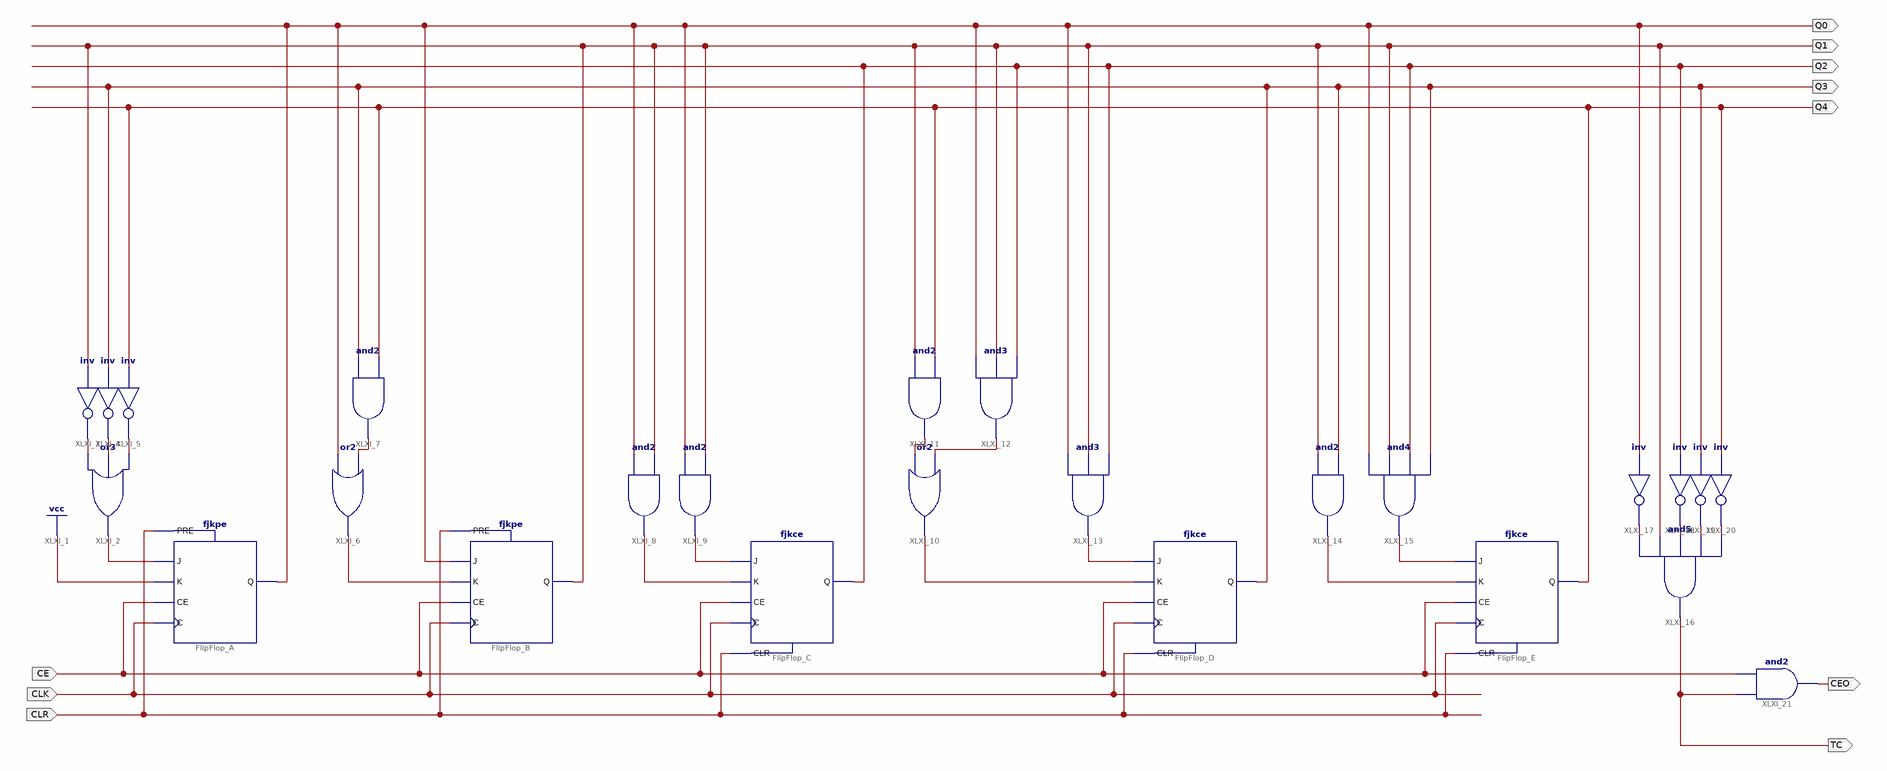
[diagram p0: schematic sheet 1]
// Xilinx ISE schematic counterm0.sch (spartan6) as structural Verilog: 25 symbols, 10 ports
module counterm0 (
  input  CE,
  input  CLK,
  input  CLR,
  output CEO,
  output TC,
  output Q0,
  output Q1,
  output Q2,
  output Q3,
  output Q4
);

  wire XLXN_2, XLXN_3, XLXN_4, XLXN_5, XLXN_6, XLXN_7, XLXN_8, XLXN_9, XLXN_10, XLXN_11, XLXN_12, XLXN_13,
       XLXN_14, XLXN_15, XLXN_16, XLXN_17, XLXN_18, XLXN_19;

  or XLXI_2 (XLXN_2, XLXN_3, XLXN_4, XLXN_5);
  not XLXI_3 (XLXN_3, Q1);
  not XLXI_4 (XLXN_4, Q3);
  not XLXI_5 (XLXN_5, Q4);
  fjkpe FlipFlop_A (.C(CLK), .CE(CE), .J(XLXN_2), .K(1'b1), .PRE(CLR), .Q(Q0));
  or XLXI_6 (XLXN_6, Q0, XLXN_7);
  and XLXI_7 (XLXN_7, Q3, Q4);
  fjkpe FlipFlop_B (.C(CLK), .CE(CE), .J(Q0), .K(XLXN_6), .PRE(CLR), .Q(Q1));
  and XLXI_8 (XLXN_8, Q0, Q1);
  and XLXI_9 (XLXN_9, Q0, Q1);
  fjkce FlipFlop_C (.C(CLK), .CE(CE), .CLR(CLR), .J(XLXN_9), .K(XLXN_8), .Q(Q2));
  or XLXI_10 (XLXN_10, XLXN_11, XLXN_12);
  and XLXI_11 (XLXN_11, Q1, Q4);
  and XLXI_12 (XLXN_12, Q0, Q1, Q2);
  and XLXI_13 (XLXN_13, Q0, Q1, Q2);
  fjkce FlipFlop_D (.C(CLK), .CE(CE), .CLR(CLR), .J(XLXN_13), .K(XLXN_10), .Q(Q3));
  and XLXI_14 (XLXN_14, Q1, Q3);
  and XLXI_15 (XLXN_15, Q0, Q1, Q2, Q3);
  fjkce FlipFlop_E (.C(CLK), .CE(CE), .CLR(CLR), .J(XLXN_15), .K(XLXN_14), .Q(Q4));
  and XLXI_16 (TC, XLXN_16, Q1, XLXN_17, XLXN_18, XLXN_19);
  not XLXI_17 (XLXN_16, Q0);
  not XLXI_18 (XLXN_17, Q2);
  not XLXI_19 (XLXN_18, Q3);
  not XLXI_20 (XLXN_19, Q4);
  and XLXI_21 (CEO, CE, TC);
endmodule
